# EAGLE design Lawnbot400_arduino2 (EAGLE 5.06)
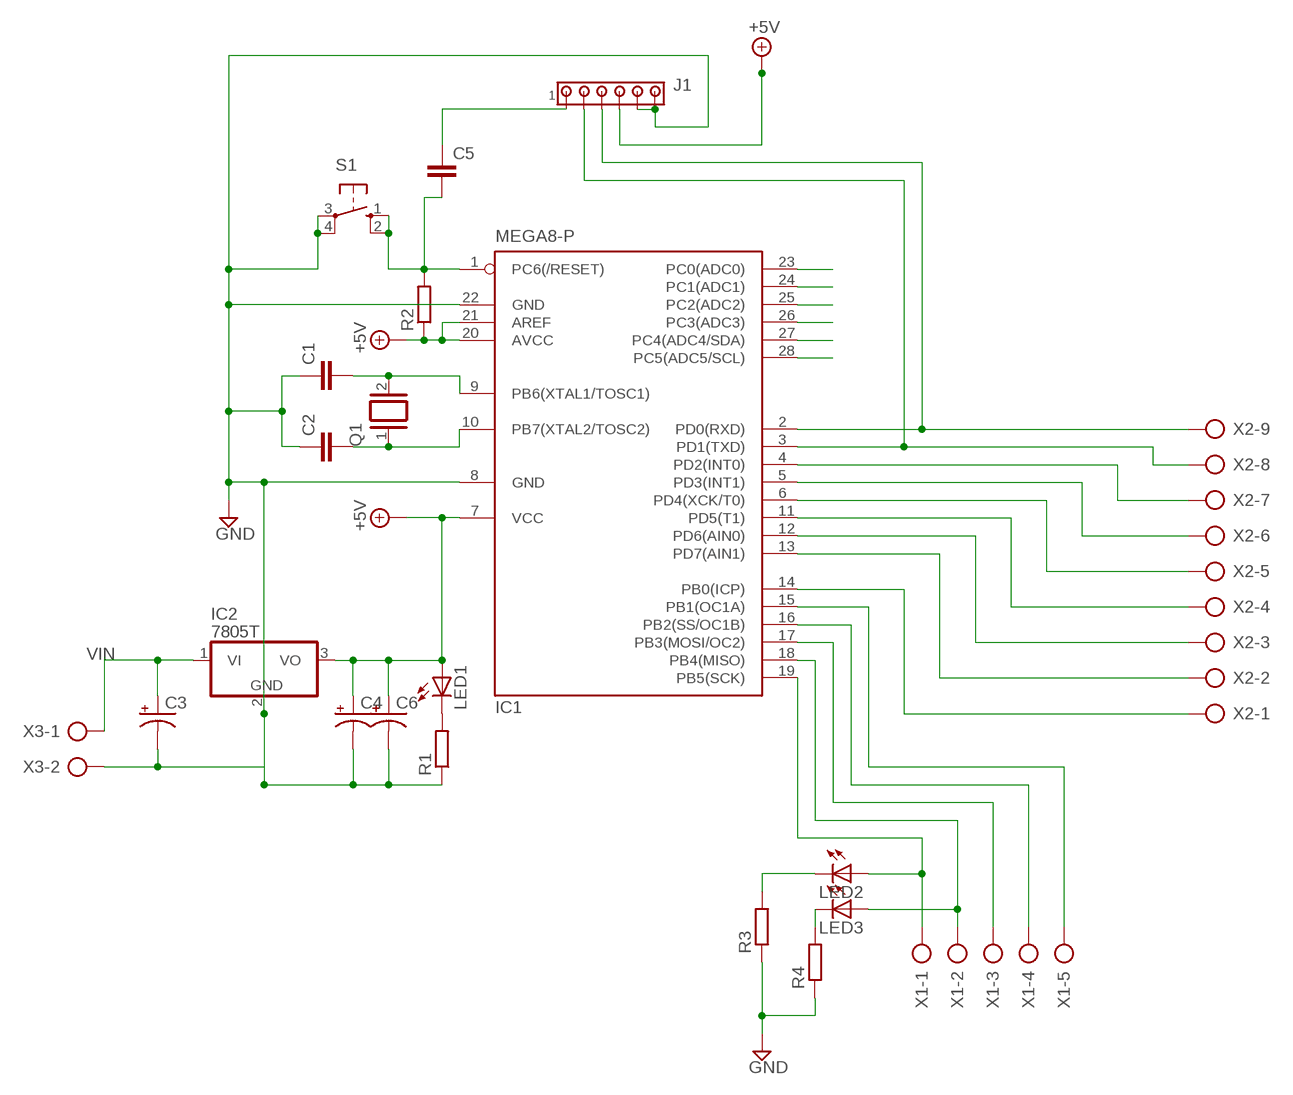
[diagram p0: schematic, sheet 1]

## Parts
C1  C2.5/2  [C2.5-2]
C2  C2.5/2  [C2.5-2]
C3  CPOL-USE2.5-6  [E2,5-6]
C4  CPOL-USE2.5-7  [E2,5-7]
C5  C-EU075-042X103  [C075-042X103]
C6  CPOL-USE2.5-6  [E2,5-6]
IC1  MEGA8-P  [DIL28-3]
IC2  7805T  [TO220H]
J1  MTA06-100  [10X06MTA]
LED1  LED3MM  [LED3MM]
LED2  LEDCHIPLED_1206  [CHIPLED_1206]
LED3  LEDCHIPLED_1206  [CHIPLED_1206]
Q1  XTAL/S  [QS]
R1  R-EU_0204/5  [0204/5]
R2  R-EU_0204/5  [0204/5]
R3  R-EU_M1206  [M1206]
R4  R-EU_M1206  [M1206]
S1  10-XX  [B3F-10XX]
X1  AK500/5  [AK500/5]
X2  AK500/9  [AK500/9]
X3  AK500/2  [AK500/2]

## Nets
+5V: C4.+ C6.+ IC1.7(VCC) IC1.20(AVCC) IC1.21(AREF) IC2.3(VO) J1.3 LED1.A R2.1
GND: C1.1 C2.1 C3.- C4.- C6.- IC1.8(GND) IC1.22(GND) IC2.2(GND) J1.1 J1.2 R1.1 R3.1 R4.1 S1.3(P) S1.4(P1) X3.2
N$1: LED1.K(C) R1.2
N$2: C5.2 IC1.1(PC6(/RESET)) R2.2 S1.1(S) S1.2(S1)
N$3: LED3.C R4.2
N$4: C5.1 J1.6
N$9: IC1.4(PD2(INT0)) X2.7
N$10: IC1.5(PD3(INT1)) X2.6
N$11: IC1.6(PD4(XCK/T0)) X2.5
N$12: IC1.11(PD5(T1)) X2.4
N$13: IC1.12(PD6(AIN0)) X2.3
N$14: IC1.13(PD7(AIN1)) X2.2
N$15: IC1.14(PB0(ICP)) X2.1
N$16: IC1.15(PB1(OC1A)) X1.5
N$17: IC1.16(PB2(SS/OC1B)) X1.4
N$18: IC1.17(PB3(MOSI/OC2)) X1.3
N$19: IC1.18(PB4(MISO)) LED3.A X1.2
N$20: IC1.19(PB5(SCK)) LED2.A X1.1
N$21: C2.2 IC1.10(PB7(XTAL2/TOSC2)) Q1.1
N$22: C1.2 IC1.9(PB6(XTAL1/TOSC1)) Q1.2
N$23: IC1.28(PC5(ADC5/SCL))
N$24: IC1.27(PC4(ADC4/SDA))
N$25: IC1.26(PC3(ADC3))
N$26: IC1.25(PC2(ADC2))
N$27: IC1.24(PC1(ADC1))
N$28: IC1.23(PC0(ADC0))
N$30: LED2.C R3.2
N$37: IC1.2(PD0(RXD)) J1.4 X2.9
N$38: IC1.3(PD1(TXD)) J1.5 X2.8
VIN: C3.+ IC2.1(VI) X3.1

## Library data of the parts
C1 C2 = capacitor-wima:C: CAPACITOR naming: grid - package width
C3 C4 C6 = rcl:CPOL-US: POLARIZED CAPACITOR, American symbol
C5 = rcl:C-EU: CAPACITOR, European symbol
IC1 = atmel:MEGA8-P: MICROCONTROLLER 8 Kbytes FLASH, 1 kbytes SRAM, 512 bytes EEPROM, USART, 4-channel 10 bit ADC, 2-channel 8 bit ADC Pin compatible with Atmega48, ATMega88, ATMega168 Source: avr.lbr
IC2 = linear:78*: Positive VOLTAGE REGULATOR Source: http://cache.national.com/ds/LM/LM78L05.pdf http://www.fairchildsemi.com/ds/LM/LM7805.pdf
J1 = con-amp:MTA06-100: AMP connector
LED1-LED3 = led:LED: LED OSRAM: - CHIPLED LG R971, LG N971, LY N971, LG Q971, LY Q971, LO R971, LY R971 LH N974, LH R974 LS Q976, LO Q976, LY Q976 LO Q996 - Hyper CHIPLED LW Q18S LB Q993, LB Q99A, LB R99A - SideLED LS A670, LO A670, LY A670, LG A670, LP A670 LB A673, LV A673, LT A673, LW A673 LH A674 LY A675 LS A676, LA A676, LO A676, LY A676, LW A676 LS A679, LY A679, LG A679 - Hyper Micro SIDELED® LS Y876, LA Y876, LO Y876, LY Y876 LT Y87S - SmartLED LW L88C, LW L88S LB L89C, LB L89S, LG L890 LS L89K, LO L89K, LY L89K LS L896, LA L896, LO L896, LY L896 - TOPLED LS T670, LO T670, LY T670, LG T670, LP T670 LSG T670, LSP T670, LSY T670, LOP T670, LYG T670 LG T671, LOG T671, LSG T671 LB T673, LV T673, LT T673, LW T673 LH T674 LS T676, LA T676, LO T676, LY T676, LB T676, LH T676, LSB T676, LW T676 LB T67C, LV T67C, LT T67C, LS T67K, LO T67K, LY T67K, LW E67C LS E67B, LA E67B, LO E67B, LY E67B, LB E67C, LV E67C, LT E67C LW T67C LS T679, LY T679, LG T679 LS T770, LO T770, LY T770, LG T770, LP T770 LB T773, LV T773, LT T773, LW T773 LH T774 LS E675, LA E675, LY E675, LS T675 LS T776, LA T776, LO T776, LY T776, LB T776 LHGB T686 LT T68C, LB T68C - Hyper Mini TOPLED® LB M676 - Mini TOPLED Santana® LG M470 LS M47K, LO M47K, LY M47K Source: http://www.osram.convergy.de LUXEON: - LUMILED® LXK2-PW12-R00, LXK2-PW12-S00, LXK2-PW14-U00, LXK2-PW14-V00 LXK2-PM12-R00, LXK2-PM12-S00, LXK2-PM14-U00 LXK2-PE12-Q00, LXK2-PE12-R00, LXK2-PE12-S00, LXK2-PE14-T00, LXK2-PE14-U00 LXK2-PB12-K00, LXK2-PB12-L00, LXK2-PB12-M00, LXK2-PB14-N00, LXK2-PB14-P00, LXK2-PB14-Q00 LXK2-PR12-L00, LXK2-PR12-M00, LXK2-PR14-Q00, LXK2-PR14-R00 LXK2-PD12-Q00, LXK2-PD12-R00, LXK2-PD12-S00 LXK2-PH12-R00, LXK2-PH12-S00 LXK2-PL12-P00, LXK2-PL12-Q00, LXK2-PL12-R00 Source: www.luxeon.com KINGBRIGHT: KA-3528ASYC Source: www.kingbright.com
Q1 = special:XTAL/S: CRYSTAL
R1 R2 = resistor:R-EU_: RESISTOR, European symbol
R3 R4 = rcl:R-EU_: RESISTOR, European symbol
S1 = switch-omron:10-XX: OMRON SWITCH
X1 = con-ptr500:AK500/5: CONNECTOR
X2 = con-ptr500:AK500/9: CONNECTOR
X3 = con-ptr500:AK500/2: CONNECTOR

## Board
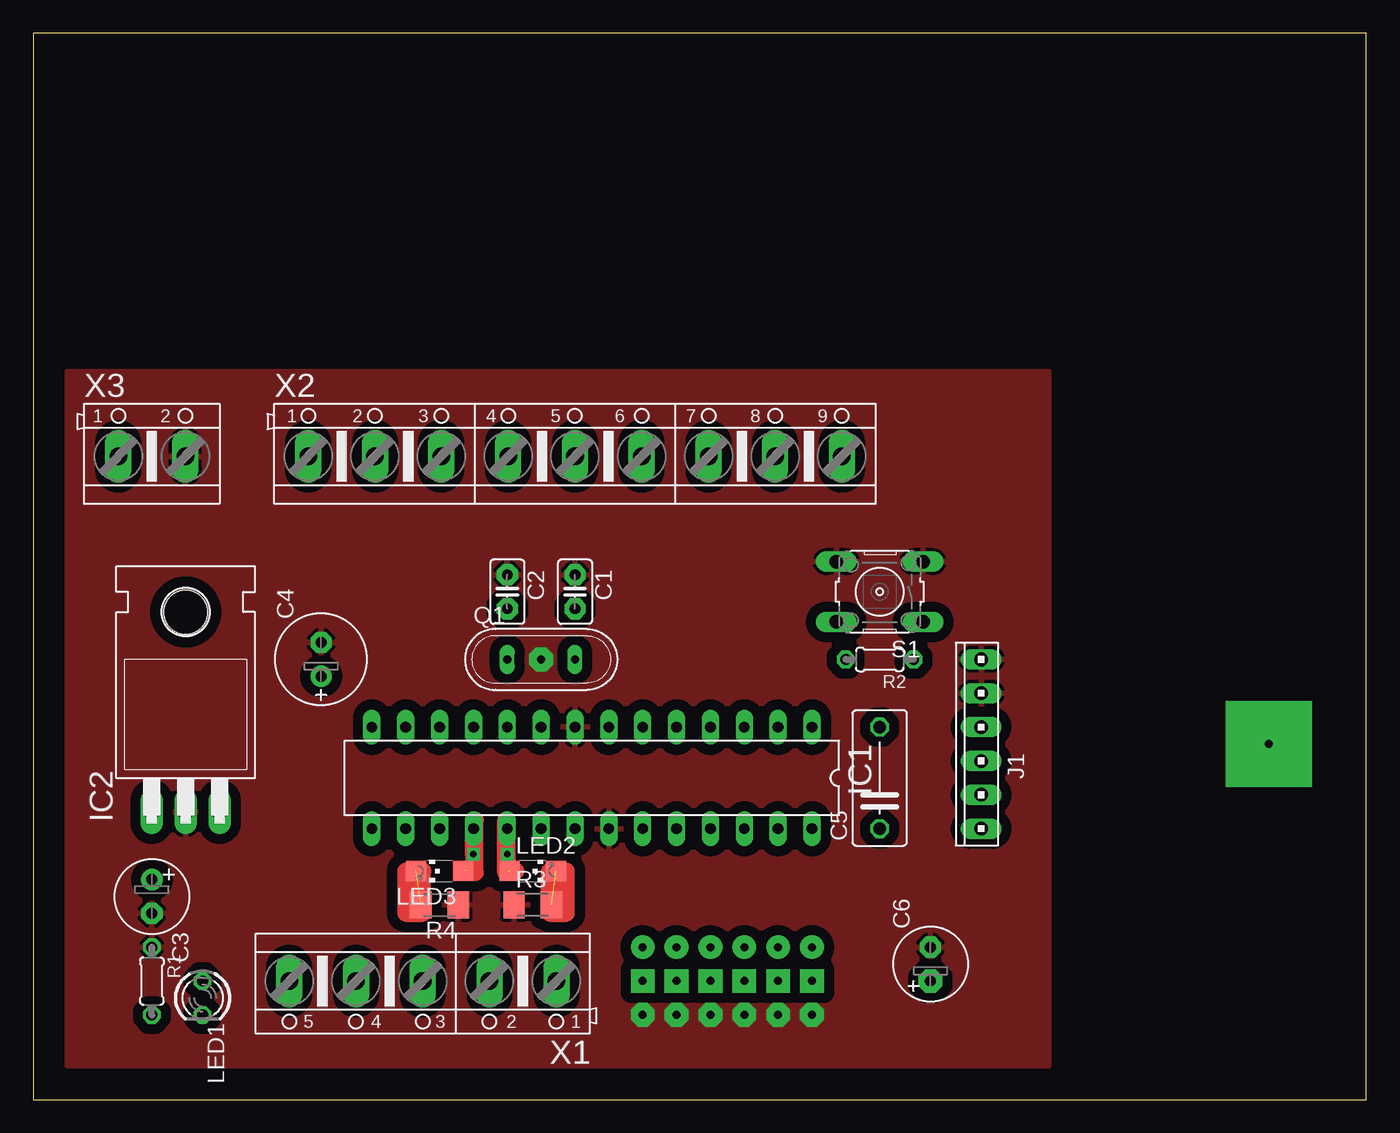
[diagram p1: board, top side]
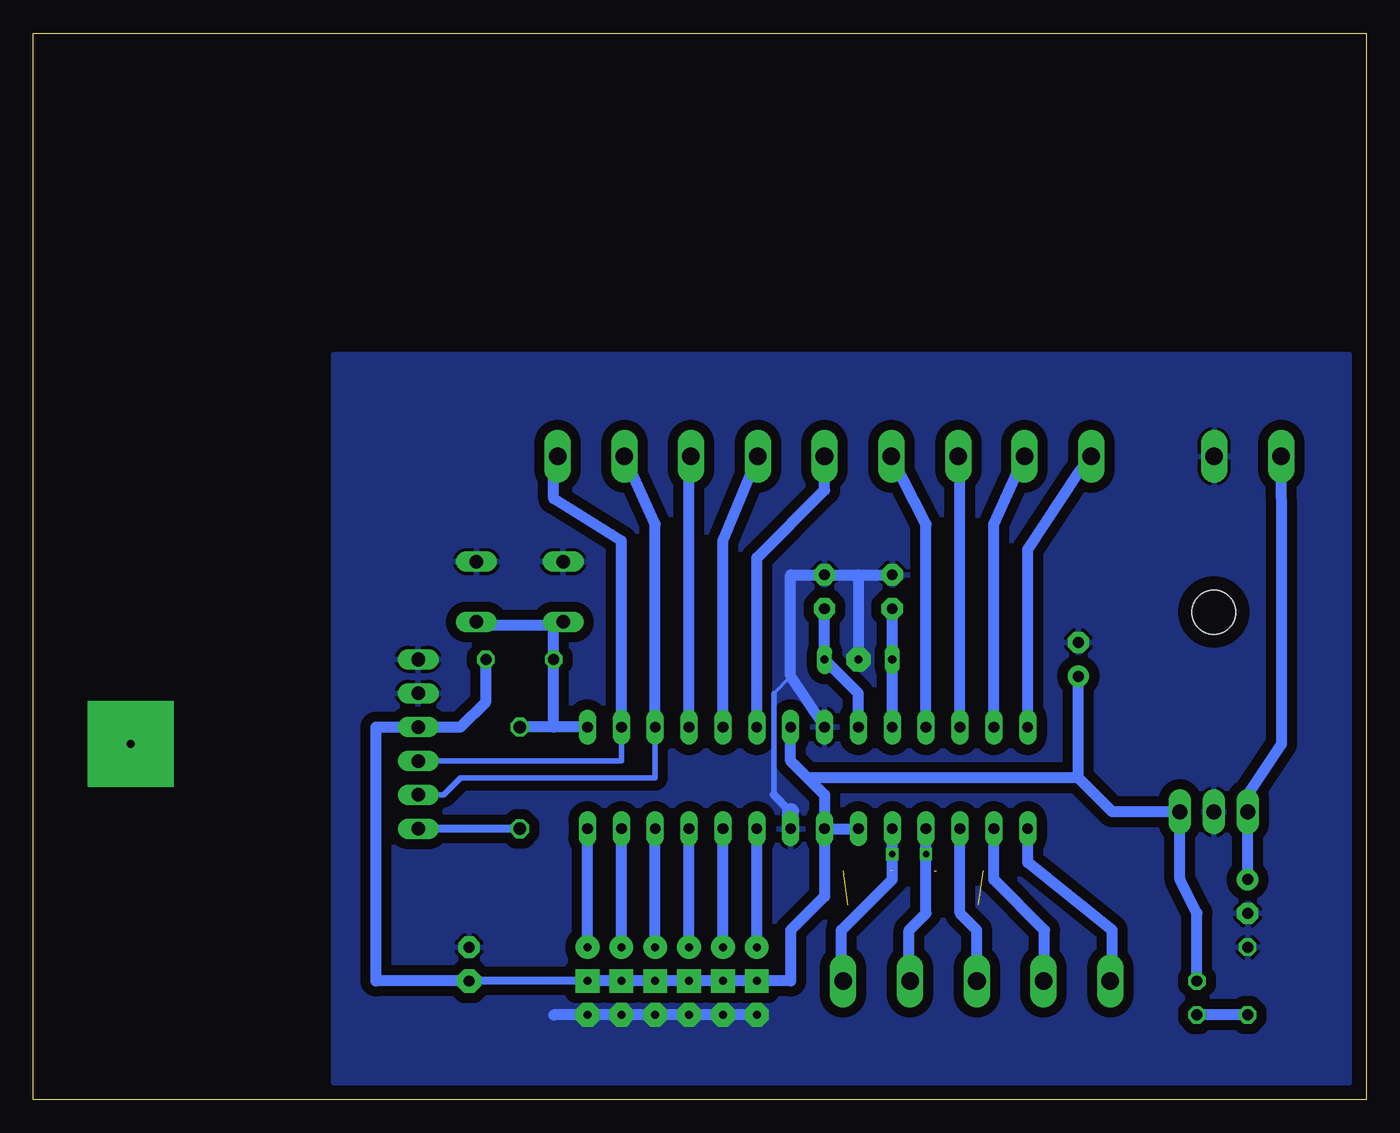
[diagram p2: board, bottom side, seen from below]

Size 100 x 80 mm. Coordinates in mm from the lower left corner, seen from the top.
Outline: 0,0 100,0 100,80 0,80 0,0
Copper layers (1*16): Top 0.035mm / dielectric 1.5mm / Bottom 0.035mm
Design rules "default *": minimum track width 10mil, minimum drill 24mil, track to track 30mil, track to pad 25mil, pad to pad 8mil, via to via 8mil, smd to smd 8mil, copper to edge 40mil, drill to drill 8mil, minimum pad ring 10mil, minimum via ring 8mil, stop-mask expansion 4mil, vias tented up to drill 0mil, thermal gap 10mil
Holes 0.6 mm at 104.14,29.84

### Footprints (pad centres in the part's own frame; a part is rotated, then mirrored left to right if it is on the bottom)
C2.5-2 = drill 0.813 pad 1.6 octagon: 1 -1.27,0; 2 1.27,0
E2,5-6 = drill 0.813 pad 1.6 round: + -1.27,0 | drill 0.813 pad 1.6 octagon: - 1.27,0
E2,5-7 = drill 0.813 pad 1.6 round: + -1.27,0 | drill 0.813 pad 1.6 octagon: - 1.27,0
C075-042X103 = drill 0.914 octagon: 1 -3.81,0; 2 3.81,0
DIL28-3 = drill 0.813 long: 1 -16.51,-3.81; 2 -13.97,-3.81; 3 -11.43,-3.81; 4 -8.89,-3.81; 5 -6.35,-3.81; 6 -3.81,-3.81; 7 -1.27,-3.81; 8 1.27,-3.81; 9 3.81,-3.81; 10 6.35,-3.81; 11 8.89,-3.81; 12 11.43,-3.81; 13 13.97,-3.81; 14 16.51,-3.81; 15 16.51,3.81; 16 13.97,3.81; 17 11.43,3.81; 18 8.89,3.81; 19 6.35,3.81; 20 3.81,3.81; 21 1.27,3.81; 22 -1.27,3.81; 23 -3.81,3.81; 24 -6.35,3.81; 25 -8.89,3.81; 26 -11.43,3.81; 27 -13.97,3.81; 28 -16.51,3.81
TO220H = drill 1.118 long: 1 -2.54,-10.16; 2 0,-10.16; 3 2.54,-10.16 | hole 3.302: 0,4.826
10X06MTA = drill 1.016 long: 1 6.35,0; 2 3.81,0; 3 1.27,0; 4 -1.27,0; 5 -3.81,0; 6 -6.35,0
LED3MM = drill 0.813 octagon: A -1.27,0; K 1.27,0
CHIPLED_1206 = smd 1.5 x 1.5: A 0,-1.75; C 0,1.75
QS = drill 0.61 long: 1 -2.54,0; 2 2.54,0
0204/5 = drill 0.813 octagon: 1 -2.54,0; 2 2.54,0
M1206 = smd 1.6 x 2: 1 -1.4,0; 2 1.4,0
B3F-10XX = drill 1.016 long: 1 -3.251,2.261; 2 3.251,2.261; 3 -3.251,-2.261; 4 3.251,-2.261
AK500/5 = drill 1.321 long: 1 -10.033,0; 2 -5.004,0; 3 0,0; 4 5.004,0; 5 10.008,0
AK500/9 = drill 1.321 long: 1 -20.015,0; 2 -15.011,0; 3 -10.033,0; 4 -5.004,0; 5 0,0; 6 5.004,0; 7 10.033,0; 8 15.011,0; 9 20.015,0
AK500/2 = drill 1.321 long: 1 -2.515,0; 2 2.515,0

### Placement (x,y rotation side)
C1  40.64,38.1 270 top
C2  35.56,38.1 270 top
C3  8.89,15.24 270 top
C4  21.59,33.02 90 top
C5  63.5,24.13 90 top
C6  67.31,10.16 90 top
IC1  41.91,24.13 180 top
IC2  11.43,31.75 0 top
J1  71.12,26.67 90 top
LED1  12.7,7.62 270 top
LED2  37.47,17.14 270 top
LED3  30.48,17.14 90 top
Q1  38.1,33.02 0 top
R1  8.89,8.89 270 top
R2  63.5,33.02 180 top
R3  37.47,14.61 0 top
R4  30.48,14.61 180 top
S1  63.5,38.1 180 top
X1  29.21,8.89 180 top
X2  40.64,48.26 0 top
X3  8.89,48.26 0 top

### Tracks (layer width: path | path; a pad name or v marks a point on that pad's centre or on a via)
+5V  (via drill 0.6 pad 1.78)
  Bottom 0.61: v58.42,8.89 C6.+
  Bottom 0.813: IC1.21 IC1.20 | IC1.7 43.18,25.4 41.91,24.13 | 41.91,24.13 40.64,22.86 IC1.21 | v58.42,8.89 v55.88,8.89 v53.34,8.89 v50.8,8.89 v48.26,8.89 v45.72,8.89 43.18,8.89 43.18,12.7 40.64,15.24 IC1.21 | LED1.A 12.7,13.97 13.97,16.51 IC2.3 19.05,21.59 21.59,24.13 | 21.59,24.13 41.91,24.13 | 21.59,24.13 C4.+ | R2.1 66.04,29.84 67.94,27.94 J1.3 74.3,27.94 74.3,8.89 C6.+
  other vias: 67.31,8.89 67.31,8.89
GND  (via drill 0.6 pad 1.78)
  Bottom 0.254: 44.45,30.48 43.18,31.75
  Bottom 0.406: 44.45,22.86 44.45,30.48
  Bottom 0.61: 43.18,21.59 44.45,22.86
  Bottom 0.813: IC1.8 43.18,31.75 43.18,39.37 C1.1 38.1,39.37 | 38.1,39.37 C2.1 | v45.72,6.35 v48.26,6.35 v50.8,6.35 v53.34,6.35 v55.88,6.35 v58.42,6.35 60.96,6.35 | 38.1,39.37 v38.1,33.02
  Bottom 1.27: IC1.22 43.18,21.59
  pour Bottom: 1.27,55.88 77.47,55.88 77.47,1.27 1.27,1.27
  pour Top: 2.54,54.61 2.54,2.54 76.2,2.54 76.2,54.61
N$1
  Bottom 0.813: R1.2 LED1.K
N$2
  Bottom 0.813: 60.96,35.56 R2.2 60.96,27.94 | 60.96,35.56 S1.2 | 60.96,35.56 66.04,35.56 S1.1 | 60.96,27.94 C5.2 | IC1.1 60.96,27.94
N$3  (1 unrouted)
N$4
  Bottom 0.61: C5.1 J1.6
N$5
  Top 1.27: 39.37,17.14 39.37,13.97 38.73,13.97 | 38.73,13.97 38.73,17.14 40.01,17.14 40.01,13.97 38.73,13.97
N$6
  Top 1.27: 36.2,17.14 35.56,17.14
N$9
  Bottom 0.254: 50.8,48.26 X2.7
  Bottom 0.813: IC1.4 50.8,48.26
N$10
  Bottom 0.813: IC1.5 48.26,41.91 X2.6
N$11
  Bottom 0.813: IC1.6 45.72,40.64 40.64,45.72 X2.5
N$12
  Bottom 0.813: IC1.11 33.02,43.18 X2.4
N$13
  Bottom 0.254: 30.48,48.26 X2.3
  Bottom 0.813: IC1.12 30.48,48.26
N$14
  Bottom 0.254: X2.2 25.4,48.26
  Bottom 0.813: IC1.13 27.94,43.18 X2.2
N$15
  Bottom 0.813: IC1.14 25.4,41.27 21.59,46.99 X2.1
N$16
  Bottom 0.254: X1.5 19.05,8.89
  Bottom 0.813: IC1.15 25.4,17.78 19.05,12.7 19.05,8.89
N$17
  Bottom 0.254: X1.4 24.13,8.89
  Bottom 0.813: IC1.16 27.94,16.51 24.13,12.7 24.13,8.89
N$18
  Bottom 0.813: X1.3 29.21,12.7 30.48,13.97 IC1.17
N$19  (via drill 0.5 pad 0.25)  (1 unrouted)
  Top 1.27: IC1.18 v33.02,18.41 33.02,17.14 32.38,17.14
  Bottom 0.254: X1.2 34.29,8.89
  Bottom 0.813: 34.29,8.89 34.29,12.7 33.02,13.97 v33.02,18.41 IC1.18
N$20  (via drill 0.5 pad 0.25)  (1 unrouted)
  Top 1.27: IC1.19 v35.56,18.41 35.56,17.14
  Bottom 0.254: X1.1 39.37,8.89
  Bottom 0.813: IC1.19 v35.56,18.41 35.56,16.51 39.37,12.7 39.37,8.89
N$21
  Bottom 0.813: C2.2 Q1.1 IC1.10
N$22
  Bottom 0.813: C1.2 Q1.2 38.1,30.48 IC1.9
N$23  (via drill 0.6 pad 1.78)
  Bottom 0.813: v58.42,11.43 IC1.28
N$24  (via drill 0.6 pad 1.78)
  Bottom 0.813: v55.88,11.43 IC1.27
N$25  (via drill 0.6 pad 1.78)
  Bottom 0.813: v53.34,11.43 IC1.26
N$26  (via drill 0.6 pad 1.78)
  Bottom 0.813: v50.8,11.43 IC1.25
N$27  (via drill 0.6 pad 1.78)
  Bottom 0.813: v48.26,11.43 IC1.24
N$28  (via drill 0.6 pad 1.78)
  Bottom 0.813: v45.72,11.43 IC1.23
N$29
  Top 1.27: 35.43,17.02 35.43,20.95
N$30  (1 unrouted)
N$31
  Top 1.27: 33.15,17.02 33.15,20.95
N$32
  Top 1.27: 29.21,17.14 29.21,13.97 27.94,13.97 27.94,17.14 28.57,17.14 28.57,14.61
N$33  (via drill 0.6 pad 6.45)
  other vias: -10.79,50.16
N$34  (via drill 0.6 pad 6.45)
  other vias: -19.68,31.11
N$35  (via drill 0.6 pad 6.45)
  other vias: -11.43,9.53
N$36  (via drill 0.6 pad 6.45)
  other vias: 92.71,26.67
N$37
  Bottom 0.254: 60.96,48.26 X2.9
  Bottom 0.406: J1.4 55.88,25.4 IC1.2
  Bottom 0.813: IC1.2 55.88,41.91 60.96,45.09 60.96,48.26
N$38
  Bottom 0.254: X2.8 55.88,48.26
  Bottom 0.406: IC1.3 53.34,24.13 67.94,24.13 69.22,22.86 J1.5
  Bottom 0.813: IC1.3 53.34,43.18 X2.8
VIN
  Bottom 0.813: X3.1 6.35,41.91 6.35,26.67 8.89,22.86 IC2.1 C3.+

### Text on the board
tOrigins: JDuino v1